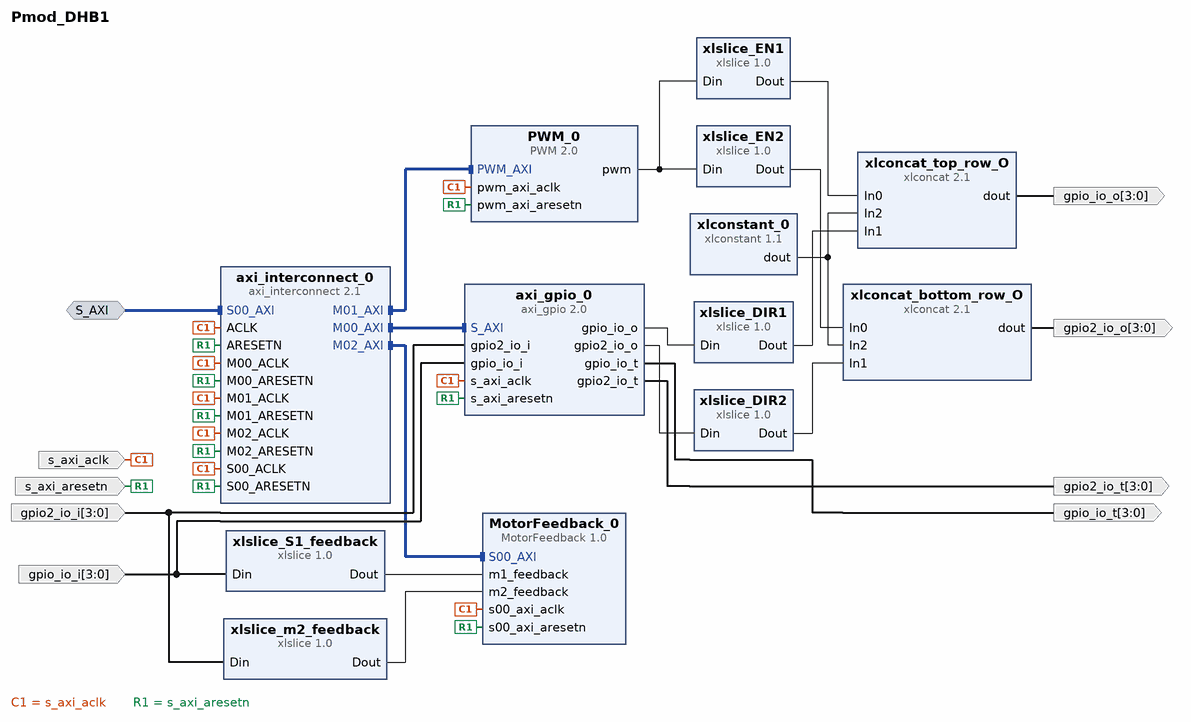
[diagram p0: block diagram of the top level]
# Vivado block design Pmod_DHB1, xc7a35ticsg324-1L, Vivado 2016.4
create_bd_design Pmod_DHB1

create_bd_intf_port -mode Slave -vlnv xilinx.com:interface:aximm_rtl:1.0 S_AXI
set_property -dict [list \
  CONFIG.DATA_WIDTH 32 \
  CONFIG.PROTOCOL AXI4 \
  CONFIG.FREQ_HZ 83333333 \
  CONFIG.ID_WIDTH 0 \
  CONFIG.ADDR_WIDTH 31 \
  CONFIG.AWUSER_WIDTH 0 \
  CONFIG.ARUSER_WIDTH 0 \
  CONFIG.WUSER_WIDTH 0 \
  CONFIG.RUSER_WIDTH 0 \
  CONFIG.BUSER_WIDTH 0 \
  CONFIG.READ_WRITE_MODE READ_WRITE \
  CONFIG.HAS_BURST 1 \
  CONFIG.HAS_LOCK 1 \
  CONFIG.HAS_PROT 1 \
  CONFIG.HAS_CACHE 1 \
  CONFIG.HAS_QOS 1 \
  CONFIG.HAS_REGION 0 \
  CONFIG.HAS_WSTRB 1 \
  CONFIG.HAS_BRESP 1 \
  CONFIG.HAS_RRESP 1 \
  CONFIG.SUPPORTS_NARROW_BURST 1 \
  CONFIG.NUM_READ_OUTSTANDING 2 \
  CONFIG.NUM_WRITE_OUTSTANDING 2 \
  CONFIG.MAX_BURST_LENGTH 256 \
  CONFIG.NUM_READ_THREADS 1 \
  CONFIG.NUM_WRITE_THREADS 1 \
  CONFIG.RUSER_BITS_PER_BYTE 0 \
  CONFIG.WUSER_BITS_PER_BYTE 0 \
] [get_bd_intf_ports S_AXI]
create_bd_port -dir O -from 3 -to 0 gpio_io_t
create_bd_port -dir O -from 3 -to 0 gpio2_io_t
create_bd_port -dir O -from 3 -to 0 gpio_io_o
create_bd_port -dir O -from 3 -to 0 gpio2_io_o
create_bd_port -dir I -from 3 -to 0 gpio_io_i
create_bd_port -dir I -from 3 -to 0 gpio2_io_i
create_bd_port -dir I -type clk s_axi_aclk
set_property -dict {CONFIG.FREQ_HZ 83333333} [get_bd_ports s_axi_aclk]
create_bd_port -dir I -type rst s_axi_aresetn

create_bd_cell -type ip -vlnv xilinx.com:ip:axi_gpio:2.0 axi_gpio_0
set_property -dict {CONFIG.C_GPIO_WIDTH 4 CONFIG.C_GPIO2_WIDTH 4 CONFIG.C_IS_DUAL 1} [get_bd_cells axi_gpio_0]
create_bd_cell -type ip -vlnv digilentinc.com:IP:MotorFeedback:1.0 MotorFeedback_0
create_bd_cell -type ip -vlnv digilentinc.com:IP:PWM:2.0 PWM_0
set_property -dict {CONFIG.NUM_PWM 2} [get_bd_cells PWM_0]
create_bd_cell -type ip -vlnv xilinx.com:ip:xlslice:1.0 xlslice_S1_feedback
set_property -dict {CONFIG.DOUT_WIDTH 1 CONFIG.DIN_TO 3 CONFIG.DIN_FROM 3 CONFIG.DIN_WIDTH 4} [get_bd_cells xlslice_S1_feedback]
create_bd_cell -type ip -vlnv xilinx.com:ip:xlslice:1.0 xlslice_m2_feedback
set_property -dict {CONFIG.DOUT_WIDTH 1 CONFIG.DIN_TO 3 CONFIG.DIN_FROM 3 CONFIG.DIN_WIDTH 4} [get_bd_cells xlslice_m2_feedback]
create_bd_cell -type ip -vlnv xilinx.com:ip:xlslice:1.0 xlslice_EN1
set_property -dict {CONFIG.DIN_TO 0 CONFIG.DIN_FROM 0 CONFIG.DIN_WIDTH 2} [get_bd_cells xlslice_EN1]
create_bd_cell -type ip -vlnv xilinx.com:ip:xlslice:1.0 xlslice_EN2
set_property -dict {CONFIG.DOUT_WIDTH 1 CONFIG.DIN_TO 1 CONFIG.DIN_FROM 1 CONFIG.DIN_WIDTH 2} [get_bd_cells xlslice_EN2]
create_bd_cell -type ip -vlnv xilinx.com:ip:xlconcat:2.1 xlconcat_top_row_O
set_property -dict {CONFIG.NUM_PORTS 3 CONFIG.IN2_WIDTH 2} [get_bd_cells xlconcat_top_row_O]
create_bd_cell -type ip -vlnv xilinx.com:ip:xlconcat:2.1 xlconcat_bottom_row_O
set_property -dict {CONFIG.NUM_PORTS 3 CONFIG.IN2_WIDTH 2} [get_bd_cells xlconcat_bottom_row_O]
create_bd_cell -type ip -vlnv xilinx.com:ip:xlslice:1.0 xlslice_DIR1
set_property -dict {CONFIG.DIN_TO 0 CONFIG.DIN_FROM 0 CONFIG.DIN_WIDTH 4} [get_bd_cells xlslice_DIR1]
create_bd_cell -type ip -vlnv xilinx.com:ip:xlslice:1.0 xlslice_DIR2
set_property -dict {CONFIG.DIN_TO 0 CONFIG.DIN_FROM 0 CONFIG.DIN_WIDTH 4} [get_bd_cells xlslice_DIR2]
create_bd_cell -type ip -vlnv xilinx.com:ip:xlconstant:1.1 xlconstant_0
set_property -dict {CONFIG.CONST_WIDTH 2 CONFIG.CONST_VAL 0} [get_bd_cells xlconstant_0]
create_bd_cell -type ip -vlnv xilinx.com:ip:axi_interconnect:2.1 axi_interconnect_0
set_property -dict {CONFIG.NUM_MI 3 CONFIG.ENABLE_ADVANCED_OPTIONS 0} [get_bd_cells axi_interconnect_0]

# ---- connections ----

connect_bd_intf_net [get_bd_intf_pins axi_gpio_0/S_AXI] [get_bd_intf_pins axi_interconnect_0/M00_AXI]
connect_bd_intf_net [get_bd_intf_pins PWM_0/PWM_AXI] [get_bd_intf_pins axi_interconnect_0/M01_AXI]
connect_bd_intf_net [get_bd_intf_pins MotorFeedback_0/S00_AXI] [get_bd_intf_pins axi_interconnect_0/M02_AXI]
connect_bd_intf_net [get_bd_intf_ports S_AXI] [get_bd_intf_pins axi_interconnect_0/S00_AXI]
connect_bd_net [get_bd_pins PWM_0/pwm] [get_bd_pins xlslice_EN1/Din] [get_bd_pins xlslice_EN2/Din]
connect_bd_net [get_bd_pins xlslice_EN1/Dout] [get_bd_pins xlconcat_top_row_O/In0]
connect_bd_net [get_bd_pins xlslice_EN2/Dout] [get_bd_pins xlconcat_bottom_row_O/In0]
connect_bd_net [get_bd_pins axi_gpio_0/gpio_io_o] [get_bd_pins xlslice_DIR1/Din]
connect_bd_net [get_bd_pins axi_gpio_0/gpio2_io_o] [get_bd_pins xlslice_DIR2/Din]
connect_bd_net [get_bd_pins xlslice_DIR1/Dout] [get_bd_pins xlconcat_top_row_O/In1]
connect_bd_net [get_bd_pins xlslice_DIR2/Dout] [get_bd_pins xlconcat_bottom_row_O/In1]
connect_bd_net [get_bd_pins xlconstant_0/dout] [get_bd_pins xlconcat_top_row_O/In2] [get_bd_pins xlconcat_bottom_row_O/In2]
connect_bd_net [get_bd_pins axi_gpio_0/gpio_io_t] [get_bd_ports gpio_io_t]
connect_bd_net [get_bd_pins axi_gpio_0/gpio2_io_t] [get_bd_ports gpio2_io_t]
connect_bd_net [get_bd_pins xlconcat_top_row_O/dout] [get_bd_ports gpio_io_o]
connect_bd_net [get_bd_pins xlconcat_bottom_row_O/dout] [get_bd_ports gpio2_io_o]
connect_bd_net [get_bd_ports gpio_io_i] [get_bd_pins axi_gpio_0/gpio_io_i] [get_bd_pins xlslice_S1_feedback/Din]
connect_bd_net [get_bd_ports gpio2_io_i] [get_bd_pins axi_gpio_0/gpio2_io_i] [get_bd_pins xlslice_m2_feedback/Din]
connect_bd_net [get_bd_ports s_axi_aclk] \
  [get_bd_pins PWM_0/pwm_axi_aclk] [get_bd_pins MotorFeedback_0/s00_axi_aclk] [get_bd_pins axi_gpio_0/s_axi_aclk] \
  [get_bd_pins axi_interconnect_0/ACLK] [get_bd_pins axi_interconnect_0/S00_ACLK] [get_bd_pins axi_interconnect_0/M00_ACLK] \
  [get_bd_pins axi_interconnect_0/M01_ACLK] [get_bd_pins axi_interconnect_0/M02_ACLK]
connect_bd_net [get_bd_ports s_axi_aresetn] \
  [get_bd_pins PWM_0/pwm_axi_aresetn] [get_bd_pins MotorFeedback_0/s00_axi_aresetn] [get_bd_pins axi_gpio_0/s_axi_aresetn] \
  [get_bd_pins axi_interconnect_0/M02_ARESETN] [get_bd_pins axi_interconnect_0/M01_ARESETN] \
  [get_bd_pins axi_interconnect_0/M00_ARESETN] [get_bd_pins axi_interconnect_0/S00_ARESETN] \
  [get_bd_pins axi_interconnect_0/ARESETN]
connect_bd_net [get_bd_pins xlslice_S1_feedback/Dout] [get_bd_pins MotorFeedback_0/m1_feedback]
connect_bd_net [get_bd_pins xlslice_m2_feedback/Dout] [get_bd_pins MotorFeedback_0/m2_feedback]

# ---- address map ----
assign_bd_address -offset 0x44A00000 -range 64K -target_address_space [get_bd_addr_spaces S_AXI] [get_bd_addr_segs axi_gpio_0/S_AXI/Reg]
assign_bd_address -offset 0x44A10000 -range 64K -target_address_space [get_bd_addr_spaces S_AXI] [get_bd_addr_segs PWM_0/PWM_AXI/PWM_AXI_reg]
assign_bd_address -offset 0x44A20000 -range 64K -target_address_space [get_bd_addr_spaces S_AXI] [get_bd_addr_segs MotorFeedback_0/S00_AXI/S00_AXI_reg]

validate_bd_design
save_bd_design
